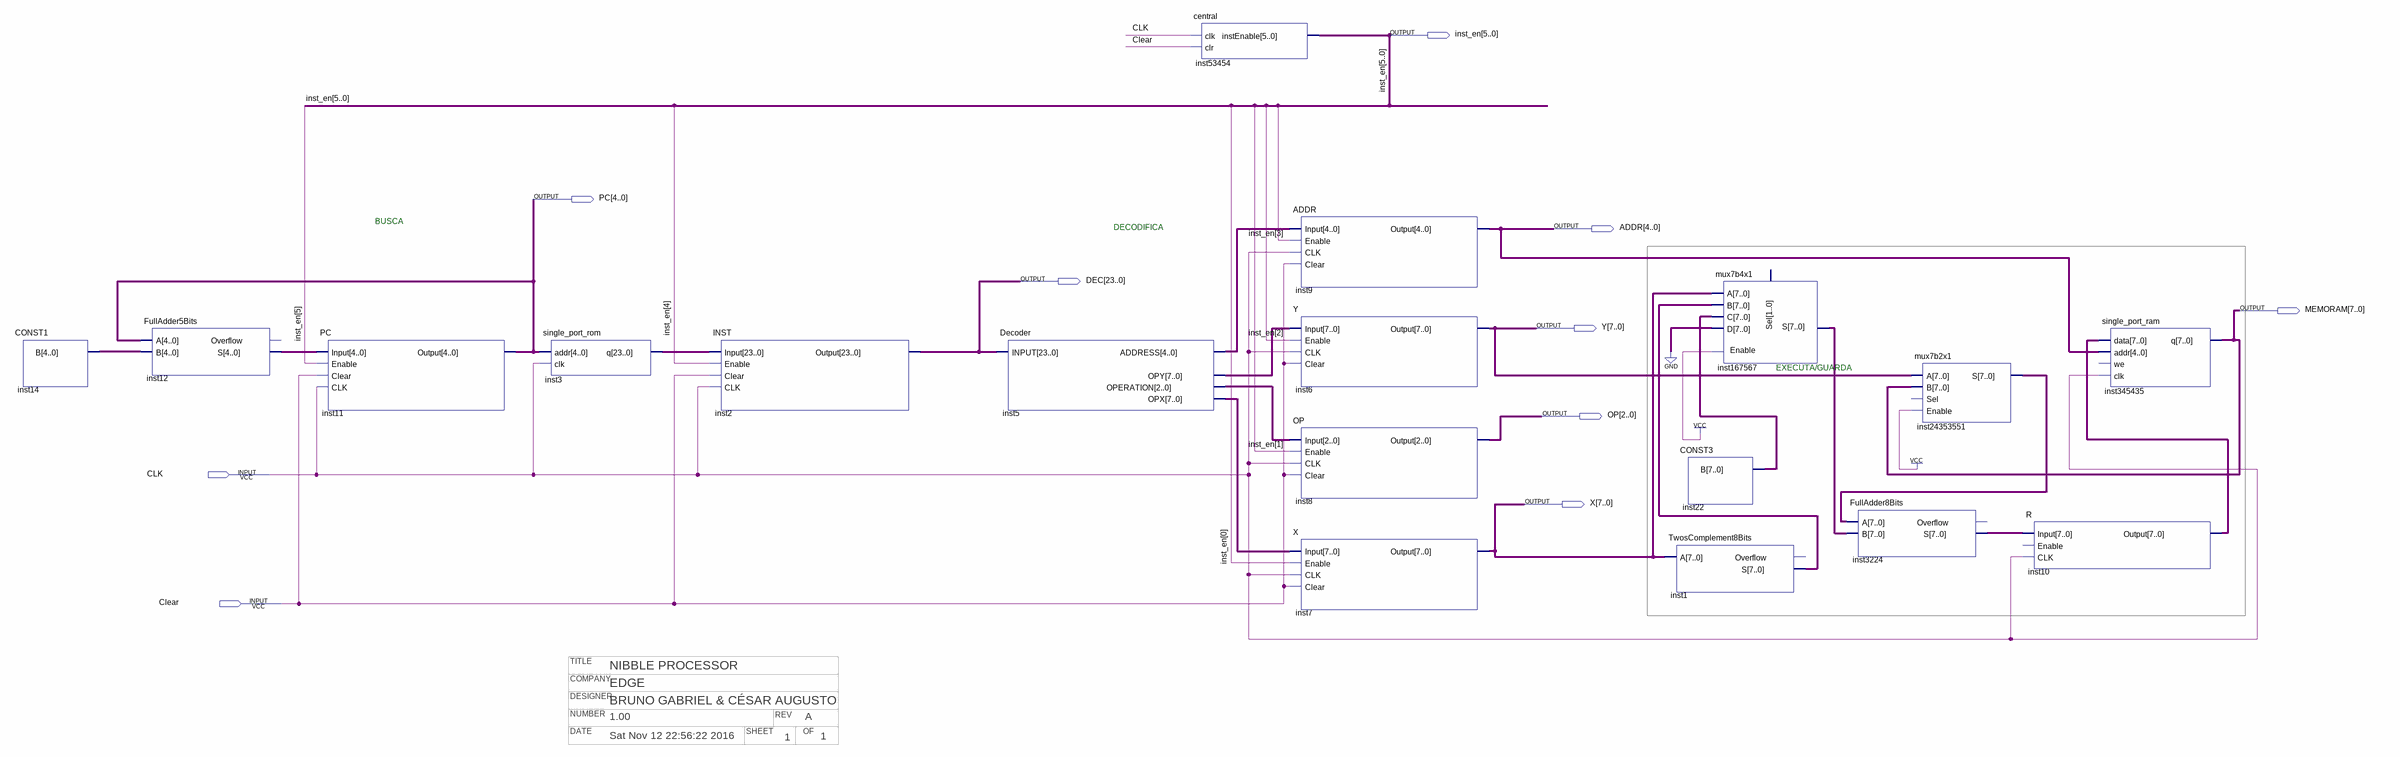
[diagram p0: schematic sheet]
// Quartus schematic NibbleProcessor.bdf as structural Verilog: 18 symbols, 10 pins
// Title block: TITLE: NIBBLE PROCESSOR; COMPANY: EDGE; DESIGNER: BRUNO GABRIEL & CÉSAR AUGUSTO; NUMBER: 1.00; REV: A; DATE: Sat Nov 12 22:56:22 2016; SHEET: 1; OF: 1
module NibbleProcessor (
  input  CLK,
  input  Clear,
  output [5:0] inst_en,
  output [4:0] PC,
  output [4:0] ADDR,
  output [23:0] DEC,
  output [7:0] MEMORAM,
  output [7:0] Y,
  output [2:0] OP,
  output [7:0] X
);

  wire [2:0] inst5_operation;
  wire [4:0] inst5_address, inst12_s, inst14_b;
  wire [7:0] inst1_s, inst5_opx, inst5_opy, inst10_output, inst22_b, inst3224_s, inst167567_s, inst24353551_s;
  wire [23:0] inst3_q;

  CONST1 inst14 (.B(inst14_b));
  FullAdder5Bits inst12 (.A(PC), .B(inst14_b), .S(inst12_s));  // open: Overflow
  PC inst11 (.Input(inst12_s), .Enable(inst_en[5]), .Clear(Clear), .CLK(CLK), .Output(PC));
  single_port_rom inst3 (.addr(PC), .clk(CLK), .q(inst3_q));
  INST inst2 (.Input(inst3_q), .Enable(inst_en[4]), .Clear(Clear), .CLK(CLK), .Output(DEC));
  Decoder inst5 (.INPUT(DEC), .OPERATION(inst5_operation), .ADDRESS(inst5_address), .OPX(inst5_opx), .OPY(inst5_opy));
  central inst53454 (.clk(CLK), .clr(Clear), .instEnable(inst_en));
  ADDR inst9 (.Input(inst5_address), .Enable(inst_en[3]), .CLK(CLK), .Clear(Clear), .Output(ADDR));
  Y inst6 (.Input(inst5_opy), .Enable(inst_en[2]), .CLK(CLK), .Clear(Clear), .Output(Y));
  OP inst8 (.Input(inst5_operation), .Enable(inst_en[1]), .CLK(CLK), .Clear(Clear), .Output(OP));
  X inst7 (.Input(inst5_opx), .Enable(inst_en[0]), .CLK(CLK), .Clear(Clear), .Output(X));
  CONST3 inst22 (.B(inst22_b));
  TwosComplement8Bits inst1 (.A(X), .S(inst1_s));  // open: Overflow
  mux7b4x1 inst167567 (.A(X), .B(inst1_s), .C(inst22_b), .D({8{1'b0}}), .Enable(1'b1), .S(inst167567_s));  // open: Sel
  FullAdder8Bits inst3224 (.A(inst24353551_s), .B(inst167567_s), .S(inst3224_s));  // open: Overflow
  mux7b2x1 inst24353551 (.A(Y), .B(MEMORAM), .Enable(1'b1), .S(inst24353551_s));  // open: Sel
  R inst10 (.Input(inst3224_s), .CLK(CLK), .Output(inst10_output));  // open: Enable
  single_port_ram inst345435 (.data(inst10_output), .addr(ADDR), .clk(CLK), .q(MEMORAM));  // open: we

  // Notes on the sheet:
  //   BUSCA
  //   DECODIFICA
  //   EXECUTA/GUARDA
endmodule
